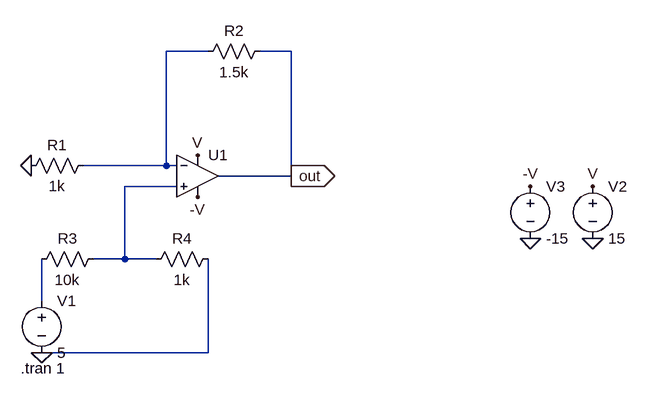
[diagram p0: schematic schematic.asc]
schematic.asc, the LTspice schematic file:
Version 4
SHEET 1 880 680
WIRE 192 -32 128 -32
WIRE 320 -32 272 -32
WIRE 128 144 128 -32
WIRE 128 144 0 144
WIRE 144 144 128 144
WIRE 320 160 320 -32
WIRE 320 160 208 160
WIRE 144 176 64 176
WIRE 64 288 64 176
WIRE 64 288 16 288
WIRE 112 288 64 288
WIRE -64 352 -64 288
WIRE 192 432 192 288
WIRE 192 432 -64 432
FLAG -80 144 0
FLAG -64 432 0
FLAG 320 160 out
IOPIN 320 160 Out
FLAG 688 176 -V
FLAG 784 176 V
FLAG 688 256 0
FLAG 784 256 0
FLAG 176 192 -V
FLAG 176 128 V
SYMBOL OpAmps\\UniversalOpAmp2 176 160 R0
SYMATTR InstName U1
SYMBOL res 16 128 R90
WINDOW 0 0 56 VBottom 2
WINDOW 3 32 56 VTop 2
SYMATTR InstName R1
SYMATTR Value 1k
SYMBOL res 288 -48 R90
WINDOW 0 0 56 VBottom 2
WINDOW 3 32 56 VTop 2
SYMATTR InstName R2
SYMATTR Value 1.5k
SYMBOL res 32 272 R90
WINDOW 0 0 56 VBottom 2
WINDOW 3 32 56 VTop 2
SYMATTR InstName R3
SYMATTR Value 10k
SYMBOL res 208 272 R90
WINDOW 0 0 56 VBottom 2
WINDOW 3 32 56 VTop 2
SYMATTR InstName R4
SYMATTR Value 1k
SYMBOL voltage -64 336 R0
WINDOW 123 0 0 Left 0
WINDOW 39 0 0 Left 0
SYMATTR InstName V1
SYMATTR Value 5
SYMBOL voltage 784 160 R0
WINDOW 123 0 0 Left 0
WINDOW 39 0 0 Left 0
SYMATTR InstName V2
SYMATTR Value 15
SYMBOL voltage 688 160 R0
WINDOW 123 0 0 Left 0
WINDOW 39 0 0 Left 0
SYMATTR InstName V3
SYMATTR Value -15
TEXT -96 456 Left 2 !.tran 1

The netlist it stands for:
* schematic.asc
XU1 N002 N001 V -V out level2 Avol=1Meg GBW=10Meg Slew=10Meg Ilimit=25m Rail=0 Vos=0 En=0 Enk=0 In=0 Ink=0 Rin=500Meg  ; pins In+ In- V+ V- OUT
R1 N001 0 1k
R2 out N001 1.5k
R3 N002 N003 10k
R4 0 N002 1k
V1 N003 0 5
V2 V 0 15
V3 -V 0 -15
.tran 1
.lib UniversalOpAmp2.lib
.backanno
.end